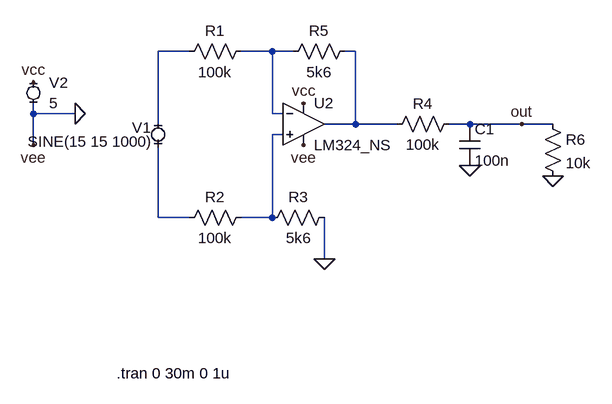
[diagram p0: schematic ltspice_simulation_opamps.asc]
ltspice_simulation_opamps.asc, the LTspice schematic file:
Version 4
SHEET 1 1344 680
WIRE -176 -112 -224 -112
WIRE -48 -112 -96 -112
WIRE -16 -112 -48 -112
WIRE 80 -112 64 -112
WIRE -416 -16 -416 -32
WIRE -352 -16 -416 -16
WIRE -48 -16 -48 -112
WIRE -32 -16 -48 -16
WIRE -224 0 -224 -112
WIRE 80 0 80 -112
WIRE 80 0 32 0
WIRE 144 0 80 0
WIRE 256 0 224 0
WIRE 336 0 256 0
WIRE 384 0 336 0
WIRE -32 16 -48 16
WIRE -416 32 -416 -16
WIRE -224 144 -224 32
WIRE -176 144 -224 144
WIRE -48 144 -48 16
WIRE -48 144 -96 144
WIRE 32 208 32 144
FLAG 336 0 out
FLAG 0 -32 vcc
FLAG 0 32 vee
FLAG -352 -16 0
FLAG -416 -64 vcc
FLAG -416 32 vee
FLAG 256 64 0
FLAG 32 208 0
FLAG 384 80 0
SYMBOL MiniSyms4\\voltage- -416 -48 R0
SYMATTR InstName V2
SYMATTR Value 5
SYMBOL EXTRA\\ExtraOpamps\\LM324_NS 0 0 R0
SYMATTR InstName U2
SYMBOL MiniSyms4\\voltage- -224 16 R180
WINDOW 0 11 11 Left 2
WINDOW 3 7 -11 Left 2
WINDOW 123 0 0 Left 2
WINDOW 39 0 0 Left 2
SYMATTR InstName V1
SYMATTR Value SINE(15 15 1000)
SYMBOL res -80 -128 R90
WINDOW 0 0 56 VBottom 2
WINDOW 3 32 56 VTop 2
SYMATTR InstName R1
SYMATTR Value 100k
SYMBOL res -80 128 R90
WINDOW 0 0 56 VBottom 2
WINDOW 3 32 56 VTop 2
SYMATTR InstName R2
SYMATTR Value 100k
SYMBOL res 48 128 R90
WINDOW 0 0 56 VBottom 2
WINDOW 3 32 56 VTop 2
SYMATTR InstName R3
SYMATTR Value 5k6
SYMBOL res 240 -16 R90
WINDOW 0 0 56 VBottom 2
WINDOW 3 32 56 VTop 2
SYMATTR InstName R4
SYMATTR Value 100k
SYMBOL cap 240 0 R0
SYMATTR InstName C1
SYMATTR Value 100n
SYMBOL res 80 -128 R90
WINDOW 0 0 56 VBottom 2
WINDOW 3 32 56 VTop 2
SYMATTR InstName R5
SYMATTR Value 5k6
SYMBOL res 368 -16 R0
SYMATTR InstName R6
SYMATTR Value 10k
TEXT -288 384 Left 2 !.tran 0 30m 0 1u

The netlist it stands for:
* ltspice_simulation_opamps.asc
V2 vcc 0 5
* U2: LM324_NS (symbol EXTRA\ExtraOpamps\LM324_NS not available, pins judged from their places): In+=N004 In-=N002 V+=vcc V-=0 OUT=N003
V1 N005 N001 SINE(15 15 1000)
R1 N002 N001 100k
R2 N004 N005 100k
R3 0 N004 5k6
R4 out N003 100k
C1 out 0 100n
R5 N003 N002 5k6
R6 out 0 10k
.tran 0 30m 0 1u
.backanno
.end